# Altium schematic sheet 24L01S.SchDoc
size A4
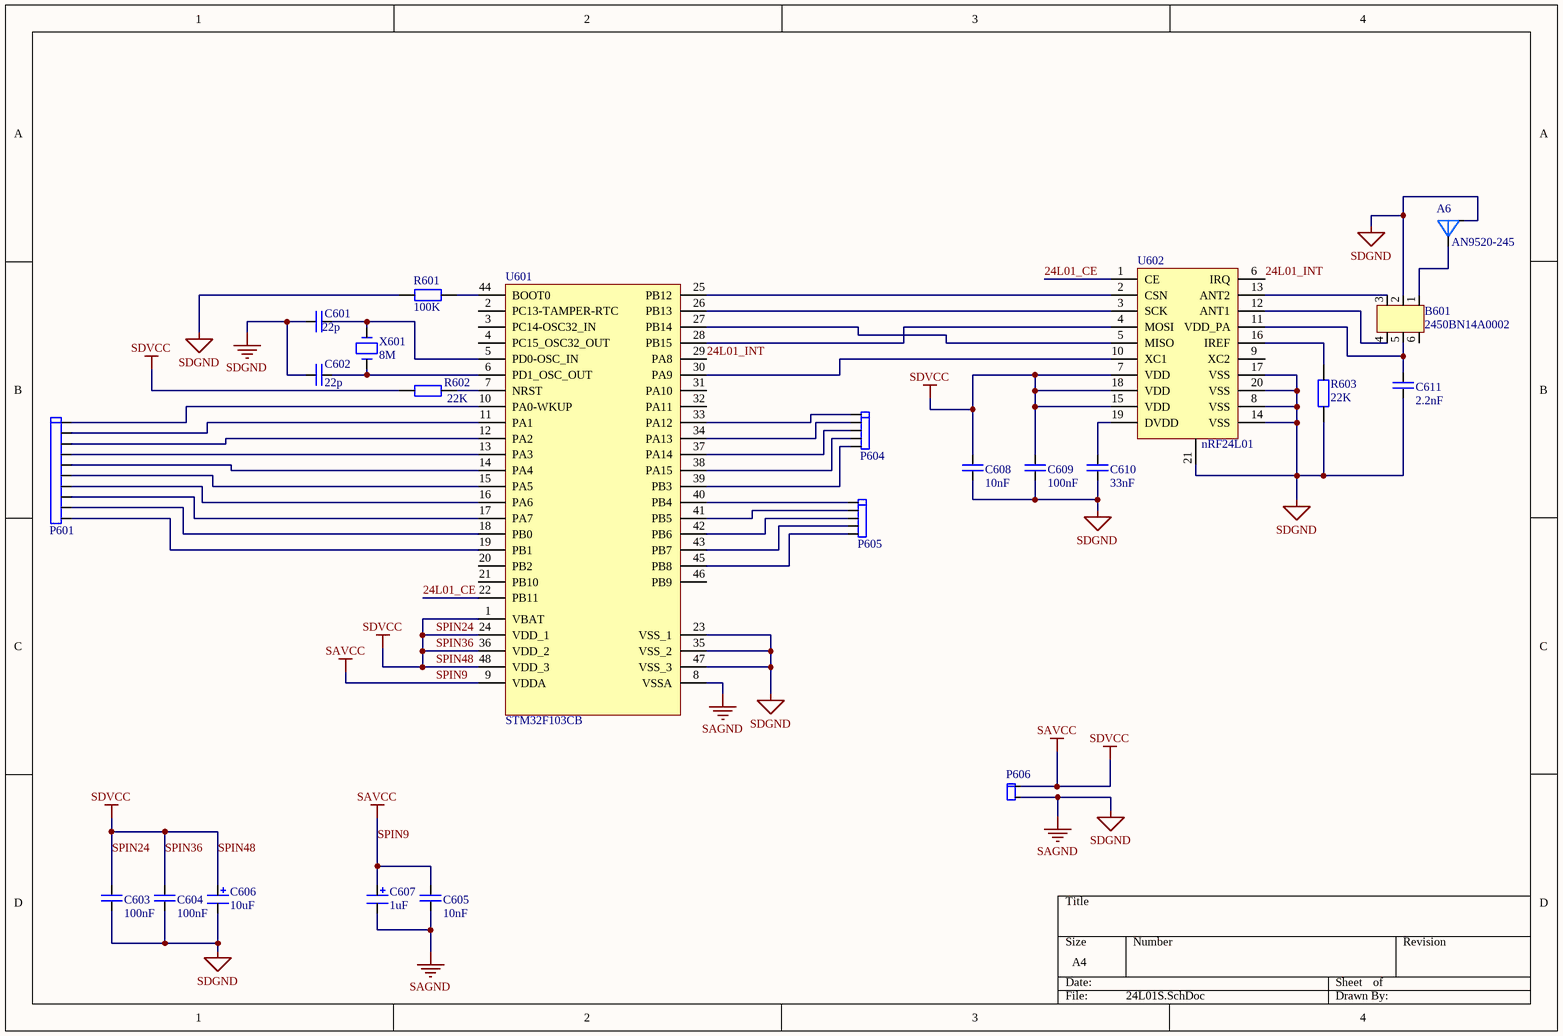
[diagram p0: 24L01S.SchDoc]

## Parts
A6  AN9520-245  [AN9520-245]
B601  2450BN14A0002  [2450BM14A0002]
C601  22p  [0603]
C602  22p  [0603]
C603  100nF  [0603]
C604  100nF  [0603]
C605  10nF  [0603]
C606  10uF  [0805]
C607  1uF  [0805]
C608  10nF  [0603]
C609  100nF  [0603]
C610  33nF  [0603]
C611  2.2nF  [0603]
P601  DIP10_1.27mm  [DIP10_1.27mm]  (value not drawn)
P604  DIP_5_1.27mm  [DIP_5_1.27mm]  (value not drawn)
P605  DIP_5_1.27mm  [DIP_5_1.27mm]  (value not drawn)
P606  DIP_2  [DIP_2]  (value not drawn)
R601  100K  [0603]
R602  22K  [0603]
R603  22K  [0603]
U601  STM32F103CB  [LQFP48]
U602  nRF24L01  [nRF24L01]
X601  8M  [X1]

## Nets
SAGND: A6.2 B601.2 C601.1 C602.1 C603.1 C604.1 C605.1 C606.2 C607.2 C608.1 C609.1 C610.1 C611.1 P606.2 R601.1 R603.2 U601.8(VSSA) U601.23(VSS_1) U601.35(VSS_2) U601.47(VSS_3) U602.8(VSS) U602.14(VSS) U602.17(VSS) U602.20(VSS) U602.21  [also labelled SDGND]
SPIN24: C603.2 C604.2 C605.2 C606.1 C607.1 C608.2 C609.2 P606.1 R602.2 U601.1(VBAT) U601.9(VDDA) U601.24(VDD_1) U601.36(VDD_2) U601.48(VDD_3) U602.7(VDD) U602.15(VDD) U602.18(VDD)  [also labelled SAVCC, SDVCC, SPIN36, SPIN48, SPIN9]
24L01_CE: U601.22(PB11) U602.1(CE)
24L01_INT: U601.29(PA8) U602.6(IRQ)
NetA6_1: A6.1 B601.1
NetB601_3: B601.3 U602.13(ANT2)
NetB601_4: B601.4 U602.12(ANT1)
NetB601_5: B601.5 C611.2 U602.11(VDD_PA)
NetC601_2: C601.2 U601.5(PD0-OSC_IN) X601.2
NetC602_2: C602.2 U601.6(PD1_OSC_OUT) X601.1
NetC610_2: C610.2 U602.19(DVDD)
NetP601_1: P601.1 U601.10(PA0-WKUP)
NetP601_2: P601.2 U601.11(PA1)
NetP601_3: P601.3 U601.12(PA2)
NetP601_4: P601.4 U601.13(PA3)
NetP601_5: P601.5 U601.14(PA4)
NetP601_6: P601.6 U601.15(PA5)
NetP601_7: P601.7 U601.16(PA6)
NetP601_8: P601.8 U601.17(PA7)
NetP601_9: P601.9 U601.18(PB0)
NetP601_10: P601.10 U601.19(PB1)
NetP604_1: P604.1 U601.33(PA12)
NetP604_2: P604.2 U601.34(PA13)
NetP604_3: P604.3 U601.37(PA14)
NetP604_4: P604.4 U601.38(PA15)
NetP604_5: P604.5 U601.39(PB3)
NetP605_1: P605.1 U601.40(PB4)
NetP605_2: P605.2 U601.41(PB5)
NetP605_3: P605.3 U601.42(PB6)
NetP605_4: P605.4 U601.43(PB7)
NetP605_5: P605.5 U601.45(PB8)
NetR601_2: R601.2 U601.44(BOOT0)
NetR602_1: R602.1 U601.7(NRST)
NetR603_1: R603.1 U602.16(IREF)
NetU601_25: U601.25(PB12) U602.2(CSN)
NetU601_26: U601.26(PB13) U602.3(SCK)
NetU601_27: U601.27(PB14) U602.5(MISO)
NetU601_28: U601.28(PB15) U602.4(MOSI)
NetU601_30: U601.30(PA9) U602.10(XC1)

Not connected (* = marked no-connect by the designer): B601 6; U601 2(PC13-TAMPER-RTC) 3(PC14-OSC32_IN) 4(PC15_OSC32_OUT) 20(PB2) 21(PB10) 31(PA10) 32(PA11) 46(PB9); U602 9(XC2)

## Library data of the parts
A6 = AN9520-245: antenna
B601 = 2450BN14A0002: nRF24L01
C601-C605 C608-C611 = C0603
C606 C607 = C0805
R601-R603 = R0603
X601 = X1